# EAGLE schematic breakout_blue (EAGLE 8.0.2)
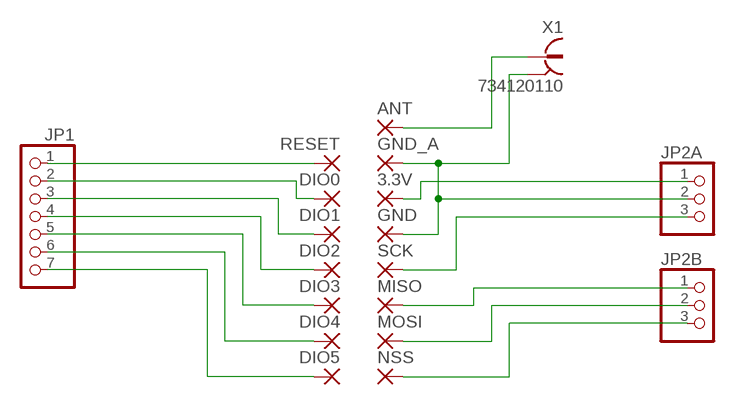
[diagram p0: schematic, sheet 1]

## Parts
3.3V  SMD1  [SMD0,65-1,27]
ANT  SMD1  [SMD0,65-1,27]
DIO0  SMD1  [SMD0,65-1,27]
DIO1  SMD1  [SMD0,65-1,27]
DIO2  SMD1  [SMD0,65-1,27]
DIO3  SMD1  [SMD0,65-1,27]
DIO4  SMD1  [SMD0,65-1,27]
DIO5  SMD1  [SMD0,65-1,27]
GND  SMD1  [SMD0,65-1,27]
GND_A  SMD1  [SMD0,65-1,27]
JP1  PINHD-1X7  [1X07]
JP2A  PINHD-1X3  [1X03]
JP2B  PINHD-1X3  [1X03]
MISO  SMD1  [SMD0,65-1,27]
MOSI  SMD1  [SMD0,65-1,27]
NSS  SMD1  [SMD0,65-1,27]
RESET  SMD1  [SMD0,65-1,27]
SCK  SMD1  [SMD0,65-1,27]
X1  734120110  [734120110]

## Nets
3.3V: 3.3V.1(P) JP2A.1
ANT: ANT.1(P) X1.1
DIO0: DIO0.1(P) JP1.2
DIO1: DIO1.1(P) JP1.3
DIO2: DIO2.1(P) JP1.4
DIO3: DIO3.1(P) JP1.5
DIO4: DIO4.1(P) JP1.6
DIO5: DIO5.1(P) JP1.7
GND: GND.1(P) GND_A.1(P) JP2A.2 X1.S@1 X1.S@2 X1.S@3
MISO: JP2B.1 MISO.1(P)
MOSI: JP2B.2 MOSI.1(P)
NSS: JP2B.3 NSS.1(P)
RESET: JP1.1 RESET.1(P)
SCK: JP2A.3 SCK.1(P)

## Library data of the parts
3.3V ANT DIO0 DIO1-DIO5 GND GND_A MISO MOSI NSS RESET SCK = wirepad:SMD1: SMD PAD
JP1 = pinhead:PINHD-1X7: PIN HEADER
JP2A JP2B = pinhead:PINHD-1X3: PIN HEADER
X1 = con-coax:734120110: MICRO COAXIAL CONNECTOR RECEPTACLE VERTICAL Source: Data sheet <http://www.molex.com/pdm_docs/sd/734120110_sd.pdf>